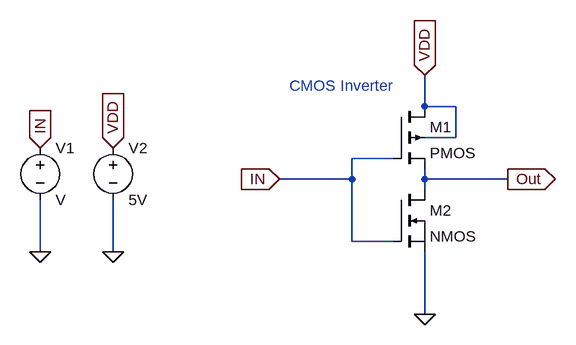
[diagram p0: schematic Draft3.asc]
Draft3.asc, the LTspice schematic file:
Version 4
SHEET 1 880 680
WIRE 240 96 240 48
WIRE 288 96 240 96
WIRE 288 144 288 96
WIRE 288 144 240 144
WIRE 192 176 128 176
WIRE 128 208 128 176
WIRE 128 208 16 208
WIRE 240 208 240 192
WIRE 368 208 240 208
WIRE 240 224 240 208
WIRE 128 304 128 208
WIRE 192 304 128 304
WIRE -352 320 -352 240
WIRE -240 320 -240 240
WIRE 240 416 240 320
FLAG 240 416 0
FLAG 16 208 IN
IOPIN 16 208 In
FLAG 368 208 Out
IOPIN 368 208 Out
FLAG 240 48 VDD
IOPIN 240 48 In
FLAG -240 160 VDD
IOPIN -240 160 In
FLAG -352 160 IN
IOPIN -352 160 In
FLAG -352 320 0
FLAG -240 320 0
SYMBOL nmos 192 224 R0
SYMATTR InstName M2
SYMBOL pmos4 192 96 R0
SYMATTR InstName M1
SYMBOL voltage -352 144 R0
SYMATTR InstName V1
SYMBOL voltage -240 144 R0
WINDOW 123 0 0 Left 0
WINDOW 39 0 0 Left 0
SYMATTR InstName V2
SYMATTR Value 5V
TEXT 32 64 Left 2 ;CMOS Inverter

The netlist it stands for:
* Draft3.asc
M2 Out IN 0 0 NMOS
M1 VDD IN Out VDD PMOS
V1 IN 0 V
V2 VDD 0 5V
.model NMOS NMOS
.model PMOS PMOS
.lib standard.mos
* CMOS Inverter
.backanno
.end